# Altium schematic sheet Oscillator.schdoc: Oscillator
size A4; Organization: Altium Limited; Address1: L3, 12a Rodborough Rd; Address2: Frenchs Forest; Address3: NSW; Address4: Australia 2086; DocumentNumber: 1; SheetNumber: 1; SheetTotal: 1
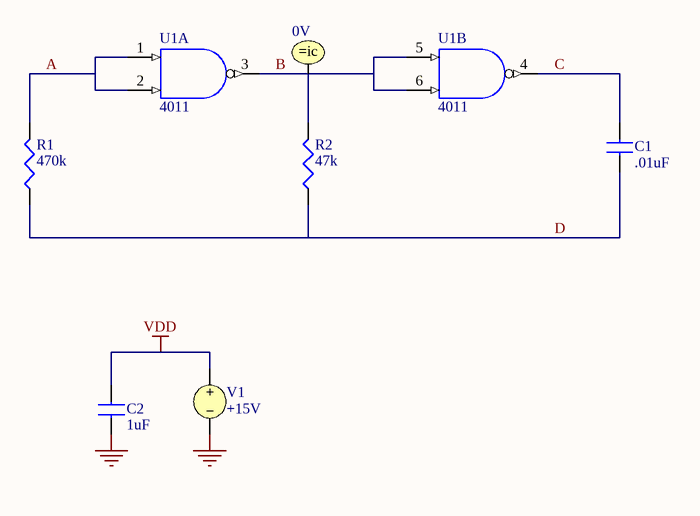
[diagram p0: Oscillator.schdoc]

## Parts
C1  .01uF
C2  1uF
IC1  0V
R1  470k
R2  47k
U1  4011  (parts A,B of 4)
V1  +15V

## Nets
GND: C2.2 U1.7(GND) V1.2
VDD: C2.1 U1.14(VDD) V1.1
A: R1.1(TOP) U1.1(A) U1.2(B)
B: IC1.1 R2.1(TOP) U1.3(Y) U1.5(A) U1.6(B)
C: C1.1 U1.4(Y)
D: C1.2 R1.2(BOT) R2.2(BOT)

## Notes on the sheet
- Title
- Size:
- Date:
- A4
- Number:
- Time:
- Revision:
- Sheet
- of
- File:

## Library data of the parts
C1 C2 = CAP: Capacitor
  C1: Value: .01uF
  C2: Value: 1uF
IC1 = .IC: Initial Condition; Initial Voltage: 0V
R1 R2 = RES: Resistor
  R1: Value: 470k
  R2: Value: 47k
U1 = 4011: Quad 2-Input NAND Gate
V1 = VSRC: Voltage Source; Value: +15V